# Altium project foxbms2-master.PrjPcb (part 8 of 8)
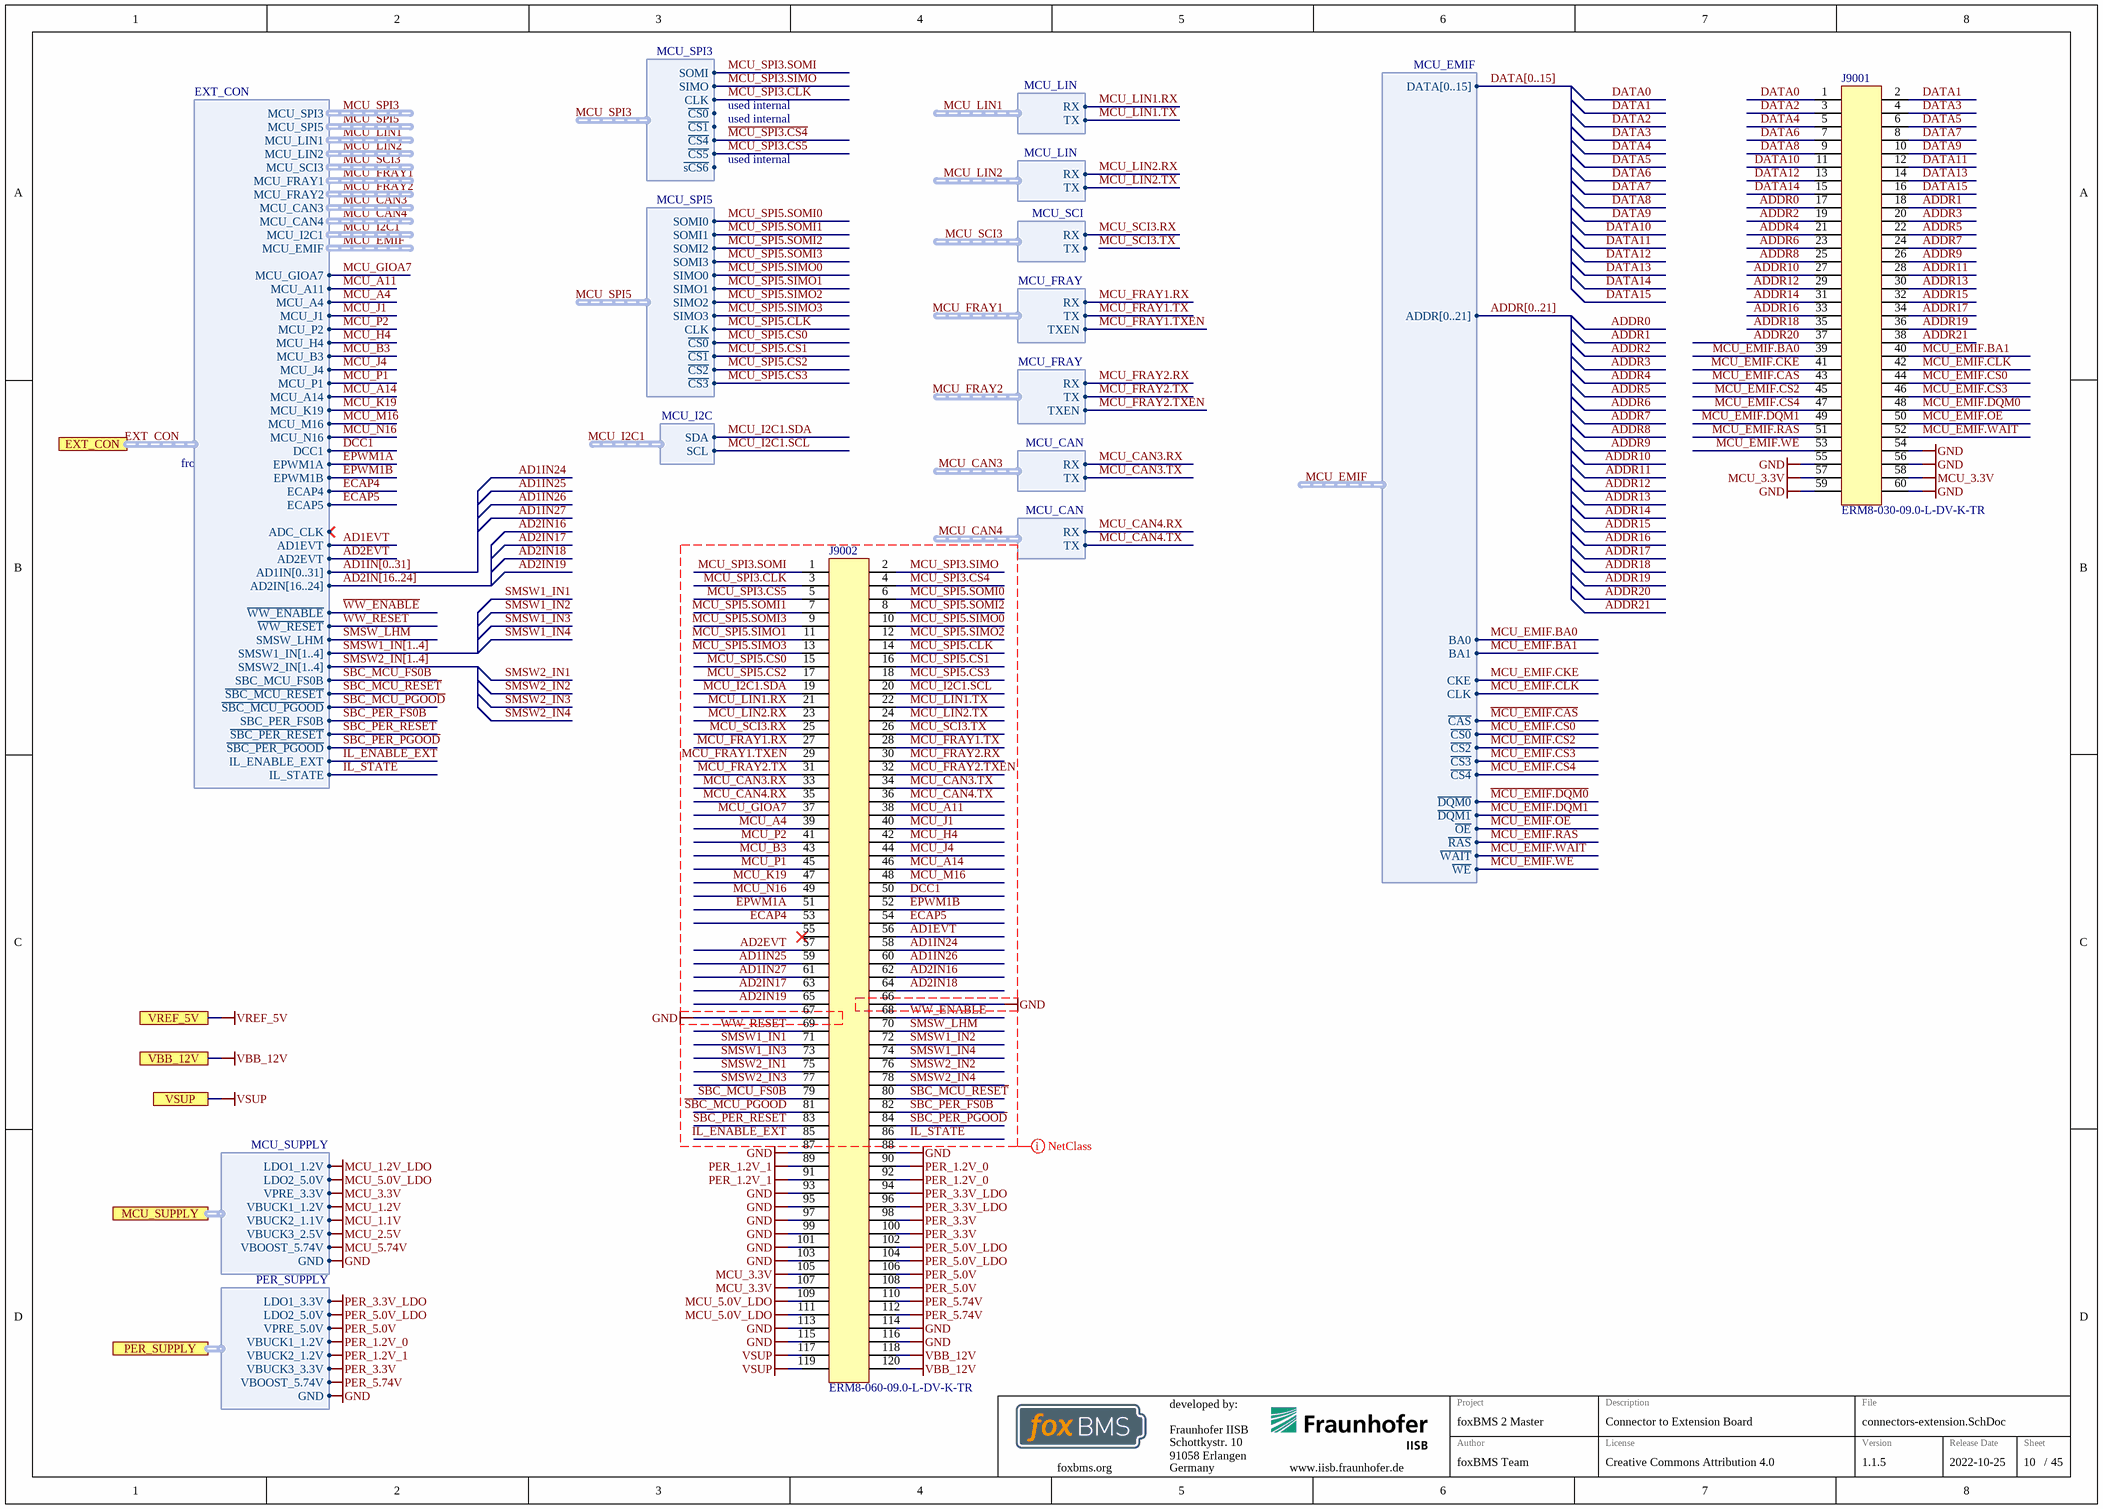
[diagram p46: connectors-extension.SchDoc]

## Nets that join several sheets
GND: mcu-com-gpio-tim (D5000.1 U5000.V4 U5000.W4), mcu-supply (62 pins), mcu-misc (U5000.U2), connectors-external (14 pins), connectors-internal (8 pins), communication/can/can-transceiver1 (13 pins), digital-isolator-3in-1out-power (C1100.1 C1102.1 U1100.2 U1100.8), ethernet-phy (33 pins), rs232-rs485-transceiver (14 pins), oscillator-20MHz (C6100.1 Y6100.2), oscillator-25MHz (C6101.1 Y6101.2), window-watchdog (10 pins), fram (C6203.1 C6204.1 U6201.4), mram (C6205.1 C6206.1 U6202.4 U6202.9), flash (C6200.1 C6201.1 C6202.1 U6200.10), sensor-hum-temp (5 pins), rtc (13 pins), peripherals/port-expanders/port-expander1 (21 pins), peripherals/port-expanders/port-expander2 (20 pins), peripherals/port-expanders/port-expander3 (20 pins), voltage-reference-5.0V (5 pins), smart-switches (R4500.1), io-devices/smart-switches/smart-switch1 (23 pins), io-devices/smart-switches/smart-switch2 (23 pins), contactor-feedback (Q4200.S R4201.1), io-devices/contactor-feedback/contactor-feedback-divider1 (D4200_1.2), io-devices/contactor-feedback/contactor-feedback-divider2 (D4200_2.2), io-devices/contactor-feedback/contactor-feedback-divider3 (D4200_3.2), io-devices/contactor-feedback/contactor-feedback-divider4 (D4200_4.2), io-devices/contactor-feedback/contactor-feedback-divider5 (D4200_5.2), io-devices/contactor-feedback/contactor-feedback-divider6 (D4200_6.2), io-devices/contactor-feedback/contactor-feedback-divider7 (D4200_7.2), io-devices/contactor-feedback/contactor-feedback-divider8 (D4200_8.2), insulation-monitoring (8 pins), supply (9 pins), buck-boost-converter (26 pins), supply/supply-protection-30 (12 pins), sbcs (15 pins), supply/sbcs/sbc-mcu (57 pins), supply/sbcs/sbc-per (57 pins), supply/supply-protection-30C (12 pins), interlock (32 pins), connectors-interface (J9000.32 J9000.33), connectors-extension (19 pins)
GND_ext: connectors-external (J2024.1), communication/can/can-transceiver2 (13 pins), digital-isolator-3in-1out-power (5 pins)
GND_SW: contactor-feedback (Q4200.D), io-devices/contactor-feedback/contactor-feedback-divider1 (R4204_1.1 R4205_1.1), io-devices/contactor-feedback/contactor-feedback-divider2 (R4204_2.1 R4205_2.1), io-devices/contactor-feedback/contactor-feedback-divider3 (R4204_3.1 R4205_3.1), io-devices/contactor-feedback/contactor-feedback-divider4 (R4204_4.1 R4205_4.1), io-devices/contactor-feedback/contactor-feedback-divider5 (R4204_5.1 R4205_5.1), io-devices/contactor-feedback/contactor-feedback-divider6 (R4204_6.1 R4205_6.1), io-devices/contactor-feedback/contactor-feedback-divider7 (R4204_7.1 R4205_7.1), io-devices/contactor-feedback/contactor-feedback-divider8 (R4204_8.1 R4205_8.1)
MCU_1.1V: ethernet-phy (11 pins), sbcs (R7203.2), supply/sbcs/sbc-mcu (5 pins)
MCU_1.2V: mcu-supply (19 pins), sbcs (R7202.2), supply/sbcs/sbc-mcu (5 pins)
MCU_1.2V_LDO: mcu-supply (C5007.2 FB5000.1), sbcs (R7200.2), supply/sbcs/sbc-mcu (C7232_1.2 C7233_1.2 U7200_1.55)
MCU_2.5V: ethernet-phy (8 pins), sbcs (R7204.2), supply/sbcs/sbc-mcu (5 pins)
MCU_3.3V: mcu-supply (38 pins), connectors-internal (6 pins), ethernet-phy (15 pins), oscillator-20MHz (C6100.2 R6100.1 Y6100.4), oscillator-25MHz (C6101.2 R6101.1 Y6101.4), window-watchdog (R6601.2 R6605.2 R6608.2), fram (C6203.2 C6204.2 R6205.2 U6201.8), mram (5 pins), flash (10 pins), rtc (8 pins), insulation-monitoring (D4400.1 D4401.1), supply (R7002.2), buck-boost-converter (R7106.2), supply/sbcs/sbc-mcu (29 pins), connectors-extension (J9001.57 J9001.58 J9002.105 J9002.107)
MCU_5.0V_LDO: mcu-supply (C5010.2 FB5001.1), window-watchdog (R6606.1), sbcs (R7201.2), supply/sbcs/sbc-mcu (C7234_1.2 C7235_1.2 U7200_1.54), connectors-extension (J9002.109 J9002.111)
MCU_5.74V: insulation-monitoring (Q4400.S R4402.2), supply/sbcs/sbc-mcu (C7220_1.2 C7221_1.2 D7201_1.1 U7200_1.53)
PER_1.2V_0: sbcs (R7214.2), supply/sbcs/sbc-per (5 pins), connectors-extension (J9002.90 J9002.92)
PER_1.2V_1: sbcs (R7215.2), supply/sbcs/sbc-per (5 pins), connectors-extension (J9002.89 J9002.91)
PER_3.3V: connectors-internal (J3001.1), communication/can/can-transceiver1 (8 pins), digital-isolator-3in-1out-power (C1100.2 C1102.2 R1100.2 U1100.1), rs232-rs485-transceiver (6 pins), sensor-hum-temp (C6500.2 R6500.2 R6501.2 U6500.5), port-expanders (R6300.2 R6301.2), peripherals/port-expanders/port-expander1 (21 pins), peripherals/port-expanders/port-expander2 (22 pins), peripherals/port-expanders/port-expander3 (22 pins), smart-switches (S4500.2), io-devices/smart-switches/smart-switch1 (7 pins), io-devices/smart-switches/smart-switch2 (7 pins), supply/sbcs/sbc-per (16 pins), interlock (R8020.1 R8024.1), connectors-interface (J9000.34 J9000.35), connectors-extension (J9002.98 J9002.100)
PER_3.3V_LDO: sbcs (R7212.2), supply/sbcs/sbc-per (C7232_2.2 C7233_2.2 U7200_2.55), connectors-extension (J9002.94 J9002.96)
PER_5.0V: communication/can/can-transceiver1 (C1110_1.2 C1111_1.2 C1112_1.2 U1101_1.3), rs232-rs485-transceiver (R1600.1), io-devices/smart-switches/smart-switch1 (C4505_1.2 U4500_1.19), io-devices/smart-switches/smart-switch2 (C4505_2.2 U4500_2.19), supply (R7003.2), sbcs (R7216.2), supply/sbcs/sbc-per (18 pins), interlock (10 pins), connectors-interface (J9000.36 J9000.37), connectors-extension (J9002.106 J9002.108)
PER_5.0V_LDO: sbcs (R7213.2), supply/sbcs/sbc-per (C7234_2.2 C7235_2.2 U7200_2.54), connectors-extension (J9002.102 J9002.104)
PER_5.74V: voltage-reference-5.0V (C4344.2 C4345.2 U4301.2), supply/sbcs/sbc-per (C7220_2.2 C7221_2.2 D7201_2.1 U7200_2.53), connectors-extension (J9002.110 J9002.112)
VBB_12V: connectors-external (9 pins), io-devices/smart-switches/smart-switch1 (10 pins), io-devices/smart-switches/smart-switch2 (10 pins), insulation-monitoring (R4410.2), supply (R7001.2 TP_VBB_12V.1), buck-boost-converter (9 pins), interlock (5 pins), connectors-interface (J9000.38), connectors-extension (J9002.118 J9002.120)
VISO_ext: communication/can/can-transceiver2 (17 pins), digital-isolator-3in-1out-power (C1101.2 C1115.2 R1102.2 U1100.16)
VREF_5V: mcu-supply (FB5002.1), voltage-reference-5.0V (C4346.2 C4347.2 U4301.6)
VSUP_30: communication/can/can-transceiver1 (5 pins), window-watchdog (C6605.2 R6607.1 U6601.5 U6601.8), rtc (D6400.1 Q6401.S R6402.2), supply (D7006.1 R7004.2 TP_VSUP_30.1), supply/supply-protection-30 (C7301_1.2 C7302_1.2 R7301_1.2 U7300_1.5), sbcs (Q7200.S R7223.1), supply/sbcs/sbc-mcu (9 pins), supply/sbcs/sbc-per (9 pins), connectors-interface (J9000.39 J9000.40), connectors-extension (J9002.117 J9002.119)
VSUP_30C: supply (R7000.2 R7006.2 TP_VSUP_30C.1), buck-boost-converter (5 pins), supply/supply-protection-30C (C7301_2.2 C7302_2.2 R7301_2.2 U7300_2.5)
VSUP_ext: connectors-external (J2009.2 J2009.6), supply/supply-protection-30 (5 pins)
VSUP_ext: connectors-external (J2009.3 J2009.7), supply/supply-protection-30C (5 pins)
~{CAN2.STB_iso}: communication/can/can-transceiver2 (R1104_2.1 U1101_2.14), digital-isolator-3in-1out-power (U1100.12)
~{DBG_RESET}: mcu-misc (U5000.B17), connectors-internal (C3000.2 J3008.9 R3004.1), window-watchdog (D6601.1 R6601.1 R6603.2 S6600.2), connectors-extension (J9002.69)
AD1IN24: mcu-adc (U5000.N18), connectors-extension (J9002.58)
AD1IN25: mcu-adc (U5000.P17), connectors-extension (J9002.59)
AD1IN26: mcu-adc (U5000.P16), connectors-extension (J9002.60)
AD1IN27: mcu-adc (U5000.P15), connectors-extension (J9002.61)
AD2IN16: mcu-adc (U5000.W13), connectors-extension (J9002.62)
AD2IN17: mcu-adc (U5000.W12), connectors-extension (J9002.63)
AD2IN18: mcu-adc (U5000.V12), connectors-extension (J9002.64)
AD2IN19: mcu-adc (U5000.U12), connectors-extension (J9002.65)
ADDR0: mcu-emif-etm-dmm (U5000.D4), connectors-extension (J9001.17)
ADDR1: mcu-emif-etm-dmm (U5000.D5), connectors-extension (J9001.18)
ADDR2: mcu-emif-etm-dmm (U5000.E6), connectors-extension (J9001.19)
ADDR3: mcu-emif-etm-dmm (U5000.E7), connectors-extension (J9001.20)
ADDR4: mcu-emif-etm-dmm (U5000.E8), connectors-extension (J9001.21)
ADDR5: mcu-emif-etm-dmm (U5000.E9), connectors-extension (J9001.22)
ADDR6: mcu-emif-etm-dmm (U5000.C4), connectors-extension (J9001.23)
ADDR7: mcu-emif-etm-dmm (U5000.C5), connectors-extension (J9001.24)
ADDR8: mcu-emif-etm-dmm (U5000.C6), connectors-extension (J9001.25)
ADDR9: mcu-emif-etm-dmm (U5000.C7), connectors-extension (J9001.26)
ADDR10: mcu-emif-etm-dmm (U5000.C8), connectors-extension (J9001.27)
ADDR11: mcu-emif-etm-dmm (U5000.C9), connectors-extension (J9001.28)
ADDR12: mcu-emif-etm-dmm (U5000.C10), connectors-extension (J9001.29)
ADDR13: mcu-emif-etm-dmm (U5000.C11), connectors-extension (J9001.30)
ADDR14: mcu-emif-etm-dmm (U5000.C12), connectors-extension (J9001.31)
ADDR15: mcu-emif-etm-dmm (U5000.C13), connectors-extension (J9001.32)
ADDR16: mcu-emif-etm-dmm (U5000.D14), connectors-extension (J9001.33)
ADDR17: mcu-emif-etm-dmm (U5000.C14), connectors-extension (J9001.34)
ADDR18: mcu-emif-etm-dmm (U5000.D15), connectors-extension (J9001.35)
ADDR19: mcu-emif-etm-dmm (U5000.C15), connectors-extension (J9001.36)
ADDR20: mcu-emif-etm-dmm (U5000.C16), connectors-extension (J9001.37)
ADDR21: mcu-emif-etm-dmm (U5000.C17), connectors-extension (J9001.38)
CAN1-CTRL~{.}STB: communication/can/can-transceiver1 (R1104_1.1 U1101_1.14), peripherals/port-expanders/port-expander2 (R6303_2.1 R6321_2.2 U6300_2.5)
CAN1-CTRL.EN: communication/can/can-transceiver1 (R1103_1.1 U1101_1.6), peripherals/port-expanders/port-expander2 (R6302_2.1 R6320_2.2 U6300_2.4)
CAN1.H: connectors-external (J2021.4), communication/can/can-transceiver1 (D1102_1.1 L1100_1.4 R1110_1.2 R1111_1.2)
CAN1.L: connectors-external (J2021.3), communication/can/can-transceiver1 (D1102_1.2 L1100_1.1 R1112_1.2 R1113_1.2)
CAN2-CTRL~{.}STB: digital-isolator-3in-1out-power (U1100.5), peripherals/port-expanders/port-expander2 (R6305_2.1 R6323_2.2 U6300_2.7)
CAN2-CTRL.EN: digital-isolator-3in-1out-power (U1100.4), peripherals/port-expanders/port-expander2 (R6304_2.1 R6322_2.2 U6300_2.6)
CAN2.EN_iso: communication/can/can-transceiver2 (R1103_2.1 U1101_2.6), digital-isolator-3in-1out-power (U1100.13)
CAN2.RX_iso: communication/can/can-transceiver2 (R1108_2.1), digital-isolator-3in-1out-power (U1100.11)
CAN2.TX_iso: communication/can/can-transceiver2 (R1107_2.1), digital-isolator-3in-1out-power (U1100.14)
COM_IO~{.}ETH_INT: mcu-com-gpio-tim (U5000.J2), ethernet-phy (R1222.1 U1200.44)
COM_IO.CAN_FAULT: mcu-com-gpio-tim (U5000.G2), communication/can/can-transceiver1 (Q1101_1.D R1114_1.2)
COM_IO.INH: can (R1101.2), supply (D7004.1), supply/sbcs/sbc-mcu (C7217_1.2 R7229_1.2 S7200_1.1)
COM_IO_PE.IO1_2: ethernet-phy (U1200.43), peripherals/port-expanders/port-expander2 (R6312_2.1 R6330_2.2 U6300_2.15)
COM_IO_PE.IO1_4: rs232-rs485-transceiver (U1600.26), peripherals/port-expanders/port-expander2 (R6314_2.1 R6332_2.2 U6300_2.17)
CONT_FB.IO0_0: connectors-external (J2000.1), io-devices/contactor-feedback/contactor-feedback-divider1 (R4202_1.2 R4203_1.2)
CONT_FB.IO0_1: connectors-external (J2002.1), io-devices/contactor-feedback/contactor-feedback-divider2 (R4202_2.2 R4203_2.2)
CONT_FB.IO0_2: connectors-external (J2003.1), io-devices/contactor-feedback/contactor-feedback-divider3 (R4202_3.2 R4203_3.2)
CONT_FB.IO0_3: connectors-external (J2004.1), io-devices/contactor-feedback/contactor-feedback-divider4 (R4202_4.2 R4203_4.2)
CONT_FB.IO0_4: connectors-external (J2006.1), io-devices/contactor-feedback/contactor-feedback-divider5 (R4202_5.2 R4203_5.2)
CONT_FB.IO0_5: connectors-external (J2007.1), io-devices/contactor-feedback/contactor-feedback-divider6 (R4202_6.2 R4203_6.2)
CONT_FB.IO0_6: connectors-external (J2008.1), io-devices/contactor-feedback/contactor-feedback-divider7 (R4202_7.2 R4203_7.2)
CONT_FB.IO0_7: connectors-external (J2010.1), io-devices/contactor-feedback/contactor-feedback-divider8 (R4202_8.2 R4203_8.2)
CONT_FB_IO.IO0_0: peripherals/port-expanders/port-expander1 (R6302_1.1 R6320_1.2 U6300_1.4), io-devices/contactor-feedback/contactor-feedback-divider1 (D4200_1.1 R4206_1.1)
CONT_FB_IO.IO0_1: peripherals/port-expanders/port-expander1 (R6303_1.1 R6321_1.2 U6300_1.5), io-devices/contactor-feedback/contactor-feedback-divider2 (D4200_2.1 R4206_2.1)
CONT_FB_IO.IO0_2: peripherals/port-expanders/port-expander1 (R6304_1.1 R6322_1.2 U6300_1.6), io-devices/contactor-feedback/contactor-feedback-divider3 (D4200_3.1 R4206_3.1)
CONT_FB_IO.IO0_3: peripherals/port-expanders/port-expander1 (R6305_1.1 R6323_1.2 U6300_1.7), io-devices/contactor-feedback/contactor-feedback-divider4 (D4200_4.1 R4206_4.1)
CONT_FB_IO.IO0_4: peripherals/port-expanders/port-expander1 (R6306_1.1 R6324_1.2 U6300_1.8), io-devices/contactor-feedback/contactor-feedback-divider5 (D4200_5.1 R4206_5.1)
CONT_FB_IO.IO0_5: peripherals/port-expanders/port-expander1 (R6307_1.1 R6325_1.2 U6300_1.9), io-devices/contactor-feedback/contactor-feedback-divider6 (D4200_6.1 R4206_6.1)
CONT_FB_IO.IO0_6: peripherals/port-expanders/port-expander1 (R6308_1.1 R6326_1.2 U6300_1.10), io-devices/contactor-feedback/contactor-feedback-divider7 (D4200_7.1 R4206_7.1)
CONT_FB_IO.IO0_7: peripherals/port-expanders/port-expander1 (R6309_1.1 R6327_1.2 U6300_1.11), io-devices/contactor-feedback/contactor-feedback-divider8 (D4200_8.1 R4206_8.1)
DATA0: mcu-emif-etm-dmm (U5000.K15), connectors-extension (J9001.1)
DATA1: mcu-emif-etm-dmm (U5000.L15), connectors-extension (J9001.2)
DATA2: mcu-emif-etm-dmm (U5000.M15), connectors-extension (J9001.3)
DATA3: mcu-emif-etm-dmm (U5000.N15), connectors-extension (J9001.4)
DATA4: mcu-emif-etm-dmm (U5000.E5), connectors-extension (J9001.5)
DATA5: mcu-emif-etm-dmm (U5000.F5), connectors-extension (J9001.6)
DATA6: mcu-emif-etm-dmm (U5000.G5), connectors-extension (J9001.7)
DATA7: mcu-emif-etm-dmm (U5000.K5), connectors-extension (J9001.8)
DATA8: mcu-emif-etm-dmm (U5000.L5), connectors-extension (J9001.9)
DATA9: mcu-emif-etm-dmm (U5000.M5), connectors-extension (J9001.10)
DATA10: mcu-emif-etm-dmm (U5000.N5), connectors-extension (J9001.11)
DATA11: mcu-emif-etm-dmm (U5000.P5), connectors-extension (J9001.12)
DATA12: mcu-emif-etm-dmm (U5000.R5), connectors-extension (J9001.13)
DATA13: mcu-emif-etm-dmm (U5000.R6), connectors-extension (J9001.14)
DATA14: mcu-emif-etm-dmm (U5000.R7), connectors-extension (J9001.15)
DATA15: mcu-emif-etm-dmm (U5000.R8), connectors-extension (J9001.16)
ETHERNET.RX1_N: connectors-external (J2001.6), ethernet-phy (T1200.9)
ETHERNET.RX1_P: connectors-external (J2001.3), ethernet-phy (T1200.11)
ETHERNET.RX2_N: connectors-external (J2001.8), ethernet-phy (T1201.9)
ETHERNET.RX2_P: connectors-external (J2001.7), ethernet-phy (T1201.11)
ETHERNET.SHIELD: connectors-external (J2001.S1 J2001.S2), ethernet-phy (R1220.2)
ETHERNET.TX1_N: connectors-external (J2001.2), ethernet-phy (T1200.14)
ETHERNET.TX1_P: connectors-external (J2001.1), ethernet-phy (T1200.16)
ETHERNET.TX2_N: connectors-external (J2001.5), ethernet-phy (T1201.14)
ETHERNET.TX2_P: connectors-external (J2001.4), ethernet-phy (T1201.16)
EXT_CON~{.}SBC_MCU_PGOOD: mcu-misc (U5000.W7), supply/sbcs/sbc-mcu (C7237_1.2 R7241_1.1 R7249_1.2), connectors-extension (J9002.81)
EXT_CON~{.}SBC_MCU_RESET: window-watchdog (C6604.2 R6605.1 U6600.2), supply/sbcs/sbc-mcu (C7236_1.2 R7240_1.1 R7248_1.1), connectors-extension (J9002.80)
EXT_CON~{.}SBC_PER_PGOOD: supply/sbcs/sbc-per (C7237_2.2 R7241_2.1 R7249_2.2), connectors-extension (J9002.84)
EXT_CON~{.}SBC_PER_RESET: supply/sbcs/sbc-per (C7236_2.2 R7240_2.1 R7248_2.1), connectors-extension (J9002.83)
EXT_CON~{.}WW_ENABLE: window-watchdog (R6600.1 R6602.2), connectors-extension (J9002.68)
EXT_CON.AD1EVT: mcu-adc (U5000.N19), connectors-extension (J9002.56)
EXT_CON.AD2EVT: mcu-adc (U5000.T10), connectors-extension (J9002.57)
EXT_CON.ADC_CLK: mcu-misc (U5000.K1), oscillator-20MHz (Y6100.3)
EXT_CON.DCC1: mcu-com-gpio-tim (U5000.J17), connectors-extension (J9002.50)
EXT_CON.ECAP4: mcu-com-gpio-tim (U5000.G19), connectors-extension (J9002.53)
EXT_CON.ECAP5: mcu-com-gpio-tim (U5000.H18), connectors-extension (J9002.54)
EXT_CON.EPWM1A: mcu-com-gpio-tim (U5000.D9), connectors-extension (J9002.51)
EXT_CON.EPWM1B: mcu-com-gpio-tim (U5000.D10), connectors-extension (J9002.52)
EXT_CON.IL_ENABLE_EXT: interlock (R8026.1), connectors-extension (J9002.85)
EXT_CON.IL_STATE: mcu-com-gpio-tim (U5000.A3), interlock (R8020.2 U8002.7), connectors-extension (J9002.86)
EXT_CON.MCU_A4: mcu-com-gpio-tim (U5000.A4), connectors-extension (J9002.39)
EXT_CON.MCU_A11: mcu-com-gpio-tim (U5000.A11), connectors-extension (J9002.38)
EXT_CON.MCU_A14: mcu-com-gpio-tim (U5000.A14), connectors-extension (J9002.46)
EXT_CON.MCU_B3: mcu-com-gpio-tim (U5000.B3), connectors-extension (J9002.43)
EXT_CON.MCU_GIOA7: mcu-com-gpio-tim (U5000.M1), connectors-extension (J9002.37)
EXT_CON.MCU_H4: mcu-com-gpio-tim (U5000.H4), connectors-extension (J9002.42)
EXT_CON.MCU_J1: mcu-com-gpio-tim (U5000.J1), connectors-extension (J9002.40)
EXT_CON.MCU_J4: mcu-com-gpio-tim (U5000.J4), connectors-extension (J9002.44)
EXT_CON.MCU_K19: mcu-com-gpio-tim (U5000.K19), connectors-extension (J9002.47)
EXT_CON.MCU_M16: mcu-com-gpio-tim (U5000.M16), connectors-extension (J9002.48)
EXT_CON.MCU_N16: mcu-com-gpio-tim (U5000.N16), connectors-extension (J9002.49)
EXT_CON.MCU_P1: mcu-com-gpio-tim (U5000.P1), connectors-extension (J9002.45)
EXT_CON.MCU_P2: mcu-com-gpio-tim (U5000.P2), connectors-extension (J9002.41)
EXT_CON.SBC_MCU_FS0B: supply/sbcs/sbc-mcu (C7243_1.2 R7243_1.2), connectors-extension (J9002.79)
EXT_CON.SBC_PER_FS0B: supply/sbcs/sbc-per (C7243_2.2 R7243_2.2), connectors-extension (J9002.82)
EXT_CON.SMSW_LHM: smart-switches (R4500.2 S4500.1), io-devices/smart-switches/smart-switch1 (U4500_1.18), io-devices/smart-switches/smart-switch2 (U4500_2.18), connectors-extension (J9002.70)
FLASH_SPI~{.}CS: mcu-com-gpio-tim (U5000.V10), flash (R6200.1 U6200.7)
FLASH_SPI.CLK: mcu-com-gpio-tim (U5000.V9), fram (U6201.6), mram (U6202.6), flash (U6200.16), connectors-extension (J9002.3)
FLASH_SPI.MISO: mcu-com-gpio-tim (U5000.V8), fram (U6201.2), mram (U6202.2), flash (R6201.1 U6200.8), connectors-extension (J9002.1)
FLASH_SPI.MOSI: mcu-com-gpio-tim (U5000.W8), fram (U6201.5), mram (U6202.5), flash (U6200.15), connectors-extension (J9002.2)
FRAM_SPI~{.}CS: mcu-com-gpio-tim (U5000.V5), fram (U6201.1)
IF_CON~{.}IF_INT0: mcu-com-gpio-tim (U5000.C1), connectors-interface (J9000.20)
IF_CON~{.}IF_INT1: mcu-com-gpio-tim (U5000.E1), connectors-interface (J9000.21)
IF_CON~{.}IF_INT2: mcu-com-gpio-tim (U5000.A6), connectors-interface (J9000.22)
IF_CON~{.}IF_INT3: mcu-com-gpio-tim (U5000.H3), connectors-interface (J9000.23)
IF_GPIO.0: peripherals/port-expanders/port-expander3 (R6310_3.1 R6328_3.2 U6300_3.13), connectors-interface (J9000.24)
IF_GPIO.1: peripherals/port-expanders/port-expander3 (R6311_3.1 R6329_3.2 U6300_3.14), connectors-interface (J9000.25)
IF_GPIO.2: peripherals/port-expanders/port-expander3 (R6312_3.1 R6330_3.2 U6300_3.15), connectors-interface (J9000.26)
IF_GPIO.3: peripherals/port-expanders/port-expander3 (R6313_3.1 R6331_3.2 U6300_3.16), connectors-interface (J9000.27)
IF_GPIO.4: peripherals/port-expanders/port-expander3 (R6314_3.1 R6332_3.2 U6300_3.17), connectors-interface (J9000.28)
IF_GPIO.5: peripherals/port-expanders/port-expander3 (R6315_3.1 R6333_3.2 U6300_3.18), connectors-interface (J9000.29)
IF_GPIO.6: peripherals/port-expanders/port-expander3 (R6316_3.1 R6334_3.2 U6300_3.19), connectors-interface (J9000.30)
IF_GPIO.7: peripherals/port-expanders/port-expander3 (R6317_3.1 R6335_3.2 U6300_3.20), connectors-interface (J9000.31)
INTERLOCK.HI: connectors-external (J2033.1), interlock (5 pins)
INTERLOCK.LO: connectors-external (J2033.2), interlock (D8001.5 R8010.2 R8014.2 R8016.1)
INTERLOCK_IO.IL_HS_CS: mcu-adc (U5000.U18), interlock (C8001.2 R8006.1 TP8001.1)
INTERLOCK_IO.IL_HS_ENABLE: mcu-com-gpio-tim (U5000.B11), interlock (R8027.1)
INTERLOCK_IO.IL_HS_VS: mcu-adc (U5000.V18), interlock (C8000.2 R8001.1 TP8000.1)
INTERLOCK_IO.IL_LS_CS: mcu-adc (U5000.R17), interlock (C8005.2 R8015.1 TP8003.1)
INTERLOCK_IO.IL_LS_VS: mcu-adc (U5000.T17), interlock (C8002.2 R8009.1 TP8002.1)
IODEV_IO~{.}SMSW_FAULT: mcu-com-gpio-tim (U5000.M2), io-devices/smart-switches/smart-switch1 (R4513_1.1 U4500_1.4), io-devices/smart-switches/smart-switch2 (R4513_2.1 U4500_2.4)
IODEV_IO~{.}SMSW_RESET: mcu-com-gpio-tim (U5000.L4), io-devices/smart-switches/smart-switch1 (U4500_1.21), io-devices/smart-switches/smart-switch2 (U4500_2.21)
IODEV_IO.CONT_FB_EN: mcu-com-gpio-tim (U5000.L16), contactor-feedback (R4200.1)
IODEV_IO.IM_OK: mcu-com-gpio-tim (U5000.A9), insulation-monitoring (D4400.2 R4401.2)
IODEV_IO.IM_PWM: mcu-com-gpio-tim (U5000.N1), insulation-monitoring (D4401.2 R4403.2)
IODEV_IO.IM_SUP_EN: mcu-com-gpio-tim (U5000.M3), insulation-monitoring (R4400.1)
iso_CAN2.H: connectors-external (J2024.4), communication/can/can-transceiver2 (D1102_2.1 L1100_2.4 R1110_2.2 R1111_2.2)
iso_CAN2.L: connectors-external (J2024.3), communication/can/can-transceiver2 (D1102_2.2 L1100_2.1 R1112_2.2 R1113_2.2)
ISOMON.OK: connectors-external (J2034.3), insulation-monitoring (R4404.2)
ISOMON.PWM: connectors-external (J2034.4), insulation-monitoring (R4406.2 R4409.1)
ISOMON.SUP-: connectors-external (J2034.1), insulation-monitoring (Q4402.D)
MCU_CAN1.RX: mcu-com-gpio-tim (U5000.B10), communication/can/can-transceiver1 (R1108_1.1)
MCU_CAN1.TX: mcu-com-gpio-tim (U5000.A10), communication/can/can-transceiver1 (R1107_1.1)
MCU_CAN2.RX: mcu-com-gpio-tim (U5000.H1), digital-isolator-3in-1out-power (U1100.6)
MCU_CAN2.TX: mcu-com-gpio-tim (U5000.H2), digital-isolator-3in-1out-power (U1100.3)
MCU_CAN3.RX: mcu-com-gpio-tim (U5000.M19), connectors-extension (J9002.33)
MCU_CAN3.TX: mcu-com-gpio-tim (U5000.M18), connectors-extension (J9002.34)
MCU_CAN4.RX: mcu-com-gpio-tim (U5000.W10), connectors-extension (J9002.35)
MCU_CAN4.TX: mcu-com-gpio-tim (U5000.F2), connectors-extension (J9002.36)
MCU_CLK.2.22MHz: mcu-misc (U5000.A12), supply/sbcs/sbc-mcu (R7251_1.1 U7200_1.20)
MCU_CLK.25MHz: mcu-misc (U5000.B5), ethernet-phy (U1200.20), oscillator-25MHz (Y6101.3)
MCU_DCC.2: mcu-com-gpio-tim (U5000.D6), rtc (U6400.6)
MCU_EMIF~{.}CAS: mcu-emif-etm-dmm (U5000.R4), connectors-extension (J9001.43)
MCU_EMIF~{.}CS0: mcu-emif-etm-dmm (U5000.N17), connectors-extension (J9001.44)
MCU_EMIF~{.}CS2: mcu-emif-etm-dmm (U5000.L17), connectors-extension (J9001.45)
MCU_EMIF~{.}CS3: mcu-emif-etm-dmm (U5000.K17), connectors-extension (J9001.46)
MCU_EMIF~{.}CS4: mcu-emif-etm-dmm (U5000.M17), connectors-extension (J9001.47)
MCU_EMIF~{.}DQM0: mcu-emif-etm-dmm (U5000.E10), connectors-extension (J9001.48)
MCU_EMIF~{.}DQM1: mcu-emif-etm-dmm (U5000.E11), connectors-extension (J9001.49)
MCU_EMIF~{.}OE: mcu-emif-etm-dmm (U5000.E12), connectors-extension (J9001.50)
MCU_EMIF~{.}RAS: mcu-emif-etm-dmm (U5000.R3), connectors-extension (J9001.51)
MCU_EMIF~{.}WAIT: mcu-emif-etm-dmm (U5000.P3), connectors-extension (J9001.52)
MCU_EMIF~{.}WE: mcu-emif-etm-dmm (U5000.D17), connectors-extension (J9001.53)
MCU_EMIF.BA0: mcu-emif-etm-dmm (U5000.E13), connectors-extension (J9001.39)
MCU_EMIF.BA1: mcu-emif-etm-dmm (U5000.D16), connectors-extension (J9001.40)
MCU_EMIF.CKE: mcu-emif-etm-dmm (U5000.L3), connectors-extension (J9001.41)
MCU_EMIF.CLK: mcu-emif-etm-dmm (U5000.K3), connectors-extension (J9001.42)
MCU_ETM.CLKIN: mcu-emif-etm-dmm (U5000.R9), connectors-internal (R3009.1)
MCU_ETM.CLKOUT: mcu-emif-etm-dmm (U5000.R10), connectors-internal (J3008.6)
MCU_ETM.CTL: mcu-emif-etm-dmm (U5000.R11), connectors-internal (J3008.36)
MCU_ETM.DATA0: mcu-emif-etm-dmm (U5000.R12), connectors-internal (J3008.38)
MCU_ETM.DATA1: mcu-emif-etm-dmm (U5000.R13), connectors-internal (J3008.28)
MCU_ETM.DATA2: mcu-emif-etm-dmm (U5000.J15), connectors-internal (J3008.26)
MCU_ETM.DATA3: mcu-emif-etm-dmm (U5000.H15), connectors-internal (J3008.24)
MCU_ETM.DATA4: mcu-emif-etm-dmm (U5000.G15), connectors-internal (J3008.22)
MCU_ETM.DATA5: mcu-emif-etm-dmm (U5000.F15), connectors-internal (J3008.20)
MCU_ETM.DATA6: mcu-emif-etm-dmm (U5000.E15), connectors-internal (J3008.18)
MCU_ETM.DATA7: mcu-emif-etm-dmm (U5000.E14), connectors-internal (J3008.16)
MCU_FRAY1.RX: mcu-com-gpio-tim (U5000.A15), connectors-extension (J9002.27)
MCU_FRAY1.TX: mcu-com-gpio-tim (U5000.B15), connectors-extension (J9002.28)
MCU_FRAY1.TXEN: mcu-com-gpio-tim (U5000.B16), connectors-extension (J9002.29)
MCU_FRAY2.RX: mcu-com-gpio-tim (U5000.A8), connectors-extension (J9002.30)
MCU_FRAY2.TX: mcu-com-gpio-tim (U5000.B8), connectors-extension (J9002.31)
MCU_FRAY2.TXEN: mcu-com-gpio-tim (U5000.B9), connectors-extension (J9002.32)
MCU_GIOA.0: mcu-com-gpio-tim (U5000.A5), supply/sbcs/sbc-mcu (U7200_1.33)
MCU_GIOA.1: mcu-com-gpio-tim (U5000.C2), supply/sbcs/sbc-per (U7200_2.33)
MCU_GIOB.1: mcu-com-gpio-tim (U5000.K2), rtc (R6401.1 U6400.12)
MCU_GIOB.4: mcu-com-gpio-tim (U5000.G1), peripherals/port-expanders/port-expander1 (R6318_1.1 U6300_1.1), peripherals/port-expanders/port-expander2 (R6318_2.1 U6300_2.1), peripherals/port-expanders/port-expander3 (R6318_3.1 U6300_3.1)
MCU_GIOB.7: mcu-com-gpio-tim (U5000.F1), buck-boost-converter (R7106.1 U7100.17)
MCU_GIOX.D11: mcu-com-gpio-tim (U5000.D11), rtc (R6410.1 U6400.10)
MCU_GIOX.D12: mcu-com-gpio-tim (U5000.D12), rtc (R6409.1 U6400.9)
MCU_GIOX.D13: mcu-com-gpio-tim (U5000.D13), rtc (R6408.1 U6400.8)
MCU_GIOX.K4: mcu-com-gpio-tim (U5000.K4), window-watchdog (R6604.1)
MCU_GIOX.K16: mcu-com-gpio-tim (U5000.K16), rtc (R6411.1 U6400.11)
MCU_GIOX.M4: mcu-com-gpio-tim (U5000.M4), peripherals/port-expanders/port-expander1 (R6319_1.1 U6300_1.3), peripherals/port-expanders/port-expander2 (R6319_2.1 U6300_2.3), peripherals/port-expanders/port-expander3 (R6319_3.1 U6300_3.3)
MCU_GIOX.N4: mcu-com-gpio-tim (U5000.N4), sbcs (Q7201.G R7225.1)
MCU_GIOX.T6: mcu-com-gpio-tim (U5000.T6), buck-boost-converter (R7105.1 U7100.1)
MCU_GIOX.T7: mcu-com-gpio-tim (U5000.T7), supply/sbcs/sbc-mcu (U7200_1.30)
MCU_GIOX.T8: mcu-com-gpio-tim (U5000.T8), supply/sbcs/sbc-per (U7200_2.30)
MCU_I2C1.SCL: mcu-com-gpio-tim (U5000.C3), sensor-hum-temp (R6500.1 U6500.4), rtc (R6403.1 U6400.2), port-expanders (R6301.1), peripherals/port-expanders/port-expander1 (U6300_1.22), peripherals/port-expanders/port-expander2 (U6300_2.22), peripherals/port-expanders/port-expander3 (U6300_3.22), connectors-extension (J9002.20)
MCU_I2C1.SDA: mcu-com-gpio-tim (U5000.B2), sensor-hum-temp (R6501.1 U6500.1), rtc (R6404.1 U6400.5), port-expanders (R6300.1), peripherals/port-expanders/port-expander1 (U6300_1.23), peripherals/port-expanders/port-expander2 (U6300_2.23), peripherals/port-expanders/port-expander3 (U6300_3.23), connectors-extension (J9002.19)
MCU_JTAG~{.}TRST: mcu-misc (U5000.D18), connectors-internal (R3000.2 R3150.1)
MCU_JTAG.RTCK: mcu-misc (U5000.A16), connectors-internal (J3008.13)
MCU_JTAG.TCK: mcu-misc (U5000.B18), connectors-internal (R3150.4)
MCU_JTAG.TDI: mcu-misc (U5000.A17), connectors-internal (R3150.2)
MCU_JTAG.TDO: mcu-misc (U5000.C18), connectors-internal (J3008.11)
MCU_JTAG.TMS: mcu-misc (U5000.C19), connectors-internal (R3150.3)
MCU_LIN1.RX: mcu-com-gpio-tim (U5000.A7), connectors-extension (J9002.21)
MCU_LIN1.TX: mcu-com-gpio-tim (U5000.B7), connectors-extension (J9002.22)
MCU_LIN2.RX: mcu-com-gpio-tim (U5000.P4), connectors-extension (J9002.23)
MCU_LIN2.TX: mcu-com-gpio-tim (U5000.T5), connectors-extension (J9002.24)
MCU_MII.RXCLK: mcu-com-gpio-tim (U5000.T4), ethernet-phy (U1200.32)
MCU_MII.RXCTRL: mcu-com-gpio-tim (U5000.U6), ethernet-phy (R1203.1 R1215.2 U1200.38)
MCU_MII.RXD0: mcu-com-gpio-tim (U5000.U4), ethernet-phy (U1200.33)
MCU_MII.RXD1: mcu-com-gpio-tim (U5000.T3), ethernet-phy (U1200.34)
MCU_MII.RXD2: mcu-com-gpio-tim (U5000.U3), ethernet-phy (U1200.35)
MCU_MII.RXD3: mcu-com-gpio-tim (U5000.V3), ethernet-phy (U1200.36)
MCU_MII.RXER: mcu-com-gpio-tim (U5000.U5), ethernet-phy (R1201.1 R1213.2 U1200.46)
MCU_MII.TXCLK: mcu-com-gpio-tim (U5000.U7), ethernet-phy (U1200.29)
MCU_MII.TXD0: mcu-com-gpio-tim (U5000.U8), ethernet-phy (U1200.25)
MCU_MII.TXD1: mcu-com-gpio-tim (U5000.R1), ethernet-phy (U1200.26)
MCU_MII.TXD2: mcu-com-gpio-tim (U5000.T2), ethernet-phy (U1200.27)
MCU_MII.TXD3: mcu-com-gpio-tim (U5000.G4), ethernet-phy (U1200.28)
MCU_MII.TXEN: mcu-com-gpio-tim (U5000.E4), ethernet-phy (U1200.37)
MCU_RST~{.}ERROR: mcu-misc (U5000.B14), sbcs (R7211.1), supply/sbcs/sbc-mcu (U7200_1.31)
MCU_SCI3.RX: mcu-com-gpio-tim (U5000.W3), connectors-extension (J9002.25)
MCU_SCI4.RX: mcu-com-gpio-tim (U5000.A13), rs232-rs485-transceiver (U1600.2)
MCU_SCI4.TX: mcu-com-gpio-tim (U5000.B13), rs232-rs485-transceiver (U1600.7)
MCU_SMI.MDC: mcu-com-gpio-tim (U5000.T9), ethernet-phy (U1200.42)
MCU_SMI.MDIO: mcu-com-gpio-tim (U5000.F4), ethernet-phy (U1200.41)
MCU_SPI1~{.}CS1: mcu-com-gpio-tim (U5000.F3), connectors-interface (J9000.6)
MCU_SPI1~{.}CS2: mcu-com-gpio-tim (U5000.G3), connectors-interface (J9000.7)
MCU_SPI1~{.}CS3: mcu-com-gpio-tim (U5000.J3), connectors-interface (J9000.8)
MCU_SPI1~{.}CS4: mcu-com-gpio-tim (U5000.U10), connectors-interface (J9000.9)
MCU_SPI1~{.}CS5: mcu-com-gpio-tim (U5000.U9), connectors-interface (J9000.10)
MCU_SPI1.CLK: mcu-com-gpio-tim (U5000.F18), connectors-interface (J9000.5)
MCU_SPI1.SIMO0: mcu-com-gpio-tim (U5000.F19), connectors-interface (J9000.3)
MCU_SPI1.SIMO1: mcu-com-gpio-tim (U5000.E18), connectors-interface (J9000.4)
MCU_SPI1.SOMI0: mcu-com-gpio-tim (U5000.G18), connectors-interface (J9000.1)
MCU_SPI1.SOMI1: mcu-com-gpio-tim (U5000.R2), connectors-interface (J9000.2)
MCU_SPI2~{.}CS0: mcu-com-gpio-tim (U5000.N3), supply/sbcs/sbc-mcu (R7247_1.1)
MCU_SPI2~{.}CS1: mcu-com-gpio-tim (U5000.D3), supply/sbcs/sbc-per (R7247_2.1)
MCU_SPI2~{.}sCS2: mcu-com-gpio-tim (U5000.D8), io-devices/smart-switches/smart-switch1 (U4500_1.6), io-devices/smart-switches/smart-switch2 (U4500_2.6)
MCU_SPI2.CLK: mcu-com-gpio-tim (U5000.E2), io-devices/smart-switches/smart-switch1 (U4500_1.8), io-devices/smart-switches/smart-switch2 (U4500_2.8), supply/sbcs/sbc-mcu (U7200_1.27), supply/sbcs/sbc-per (U7200_2.27)
MCU_SPI2.SIMO: mcu-com-gpio-tim (U5000.D1), io-devices/smart-switches/smart-switch1 (U4500_1.7), supply/sbcs/sbc-mcu (U7200_1.26), supply/sbcs/sbc-per (U7200_2.26)
MCU_SPI2.SOMI: mcu-com-gpio-tim (U5000.D2), io-devices/smart-switches/smart-switch2 (U4500_2.9), supply/sbcs/sbc-mcu (U7200_1.25), supply/sbcs/sbc-per (U7200_2.25)
MCU_SPI3~{.}CS4: mcu-com-gpio-tim (U5000.E3), connectors-extension (J9002.4)
MCU_SPI3~{.}CS5: mcu-com-gpio-tim (U5000.W9), connectors-extension (J9002.5)
MCU_SPI3~{.}sCS6: mcu-com-gpio-tim (U5000.D7), mram (U6202.1)
MCU_SPI4~{.}CS0: mcu-com-gpio-tim (U5000.U1), connectors-interface (J9000.14)
MCU_SPI4~{.}CS1: mcu-com-gpio-tim (U5000.B12), connectors-interface (J9000.15)
MCU_SPI4~{.}CS2: mcu-com-gpio-tim (U5000.T1), connectors-interface (J9000.16)
MCU_SPI4~{.}CS3: mcu-com-gpio-tim (U5000.V7), connectors-interface (J9000.17)
MCU_SPI4~{.}CS4: mcu-com-gpio-tim (U5000.D19), connectors-interface (J9000.18)
MCU_SPI4~{.}CS5: mcu-com-gpio-tim (U5000.B4), connectors-interface (J9000.19)
MCU_SPI4.CLK: mcu-com-gpio-tim (U5000.K18), connectors-interface (J9000.13)
MCU_SPI4.SIMO: mcu-com-gpio-tim (U5000.W5), connectors-interface (J9000.12)
MCU_SPI4.SOMI: mcu-com-gpio-tim (U5000.V6), connectors-interface (J9000.11)
MCU_SPI5~{.}CS0: mcu-com-gpio-tim (U5000.E19), connectors-extension (J9002.15)
MCU_SPI5~{.}CS1: mcu-com-gpio-tim (U5000.B6), connectors-extension (J9002.16)
MCU_SPI5~{.}CS2: mcu-com-gpio-tim (U5000.W6), connectors-extension (J9002.17)
MCU_SPI5~{.}CS3: mcu-com-gpio-tim (U5000.T12), connectors-extension (J9002.18)
MCU_SPI5.CLK: mcu-com-gpio-tim (U5000.H19), connectors-extension (J9002.14)
MCU_SPI5.SIMO0: mcu-com-gpio-tim (U5000.J19), connectors-extension (J9002.10)
MCU_SPI5.SIMO1: mcu-com-gpio-tim (U5000.E16), connectors-extension (J9002.11)
MCU_SPI5.SIMO2: mcu-com-gpio-tim (U5000.H17), connectors-extension (J9002.12)
MCU_SPI5.SIMO3: mcu-com-gpio-tim (U5000.G17), connectors-extension (J9002.13)
MCU_SPI5.SOMI0: mcu-com-gpio-tim (U5000.J18), connectors-extension (J9002.6)
MCU_SPI5.SOMI1: mcu-com-gpio-tim (U5000.E17), connectors-extension (J9002.7)
MCU_SPI5.SOMI2: mcu-com-gpio-tim (U5000.H16), connectors-extension (J9002.8)
MCU_SPI5.SOMI3: mcu-com-gpio-tim (U5000.G16), connectors-extension (J9002.9)
NetC7201_1: sbcs (C7201.1 R7210.2), supply/sbcs/sbc-mcu (U7200_1.41)
NetC7203_1: sbcs (C7203.1 R7222.2), supply/sbcs/sbc-per (U7200_2.41)
NetR1101_1: can (R1101.1), communication/can/can-transceiver1 (U1101_1.7)
NetR7211_2: sbcs (R7211.2), supply/sbcs/sbc-per (U7200_2.31)
NetR7251_2_1: supply/sbcs/sbc-mcu (U7200_1.24), supply/sbcs/sbc-per (R7251_2.1 U7200_2.20)
NetU4500_1_9: io-devices/smart-switches/smart-switch1 (U4500_1.9), io-devices/smart-switches/smart-switch2 (U4500_2.7)
PE_IO3.IO0_0: sensor-hum-temp (U6500.6), peripherals/port-expanders/port-expander3 (R6302_3.1 R6320_3.2 U6300_3.4)
PE_IO3.IO0_1: sensor-hum-temp (U6500.3), peripherals/port-expanders/port-expander3 (R6303_3.1 R6321_3.2 U6300_3.5)
PER_IO~{.}RTC_INTA_HV: rtc (Q6401.D R6406.2), supply/sbcs/sbc-mcu (C7225_1.2 R7231_1.2)
RS485.A: connectors-external (J2013.2), rs232-rs485-transceiver (R1611.1 R1612.2 R1613.2 U1600.22)
RS485.B: connectors-external (J2013.5), rs232-rs485-transceiver (U1600.21)
RS485.Y: connectors-external (J2013.1), rs232-rs485-transceiver (U1600.19)
RS485.Z: connectors-external (J2013.4), rs232-rs485-transceiver (R1609.1 R1610.1 R1611.2 U1600.17)
SBC_MCU_OTP.DBG: connectors-internal (J3000.6), supply/sbcs/sbc-mcu (D7203_1.2)
SBC_MCU_OTP.DBGHV: connectors-internal (J3000.4), supply/sbcs/sbc-mcu (D7203_1.1 R7235_1.1 U7200_1.8)
SBC_MCU_OTP.SCL: connectors-internal (J3000.5), supply/sbcs/sbc-mcu (R7237_1.1 U7200_1.10)
SBC_MCU_OTP.SDA: connectors-internal (J3000.3), supply/sbcs/sbc-mcu (R7236_1.1 U7200_1.11)
SBC_PER_OTP.DBG: connectors-internal (J3001.6), supply/sbcs/sbc-per (D7203_2.2)
SBC_PER_OTP.DBGHV: connectors-internal (J3001.4), supply/sbcs/sbc-per (D7203_2.1 R7235_2.1 U7200_2.8)
SBC_PER_OTP.SCL: connectors-internal (J3001.5), supply/sbcs/sbc-per (R7237_2.1 U7200_2.10)
SBC_PER_OTP.SDA: connectors-internal (J3001.3), supply/sbcs/sbc-per (R7236_2.1 U7200_2.11)
SMSW1_IN1: io-devices/smart-switches/smart-switch1 (R4514_1.1), connectors-extension (J9002.71)
SMSW1_IN2: io-devices/smart-switches/smart-switch1 (R4515_1.1), connectors-extension (J9002.72)
SMSW1_IN3: io-devices/smart-switches/smart-switch1 (R4516_1.1), connectors-extension (J9002.73)
SMSW1_IN4: io-devices/smart-switches/smart-switch1 (R4517_1.1), connectors-extension (J9002.74)
SMSW2_IN1: io-devices/smart-switches/smart-switch2 (R4514_2.1), connectors-extension (J9002.75)
SMSW2_IN2: io-devices/smart-switches/smart-switch2 (R4515_2.1), connectors-extension (J9002.76)
SMSW2_IN3: io-devices/smart-switches/smart-switch2 (R4516_2.1), connectors-extension (J9002.77)
SMSW2_IN4: io-devices/smart-switches/smart-switch2 (R4517_2.1), connectors-extension (J9002.78)
SMSW_OUT1.1: connectors-external (J2000.3), io-devices/smart-switches/smart-switch1 (C4502_1.2 D4500_1.1 R4501_1.2 U4500_1.3)
SMSW_OUT1.2: connectors-external (J2002.3), io-devices/smart-switches/smart-switch1 (C4504_1.2 D4501_1.1 R4502_1.2 U4500_1.26)
SMSW_OUT1.3: connectors-external (J2003.3), io-devices/smart-switches/smart-switch1 (C4506_1.2 D4502_1.1 R4503_1.2 U4500_1.12)
SMSW_OUT1.4: connectors-external (J2004.3), io-devices/smart-switches/smart-switch1 (C4507_1.2 D4503_1.1 R4508_1.2 U4500_1.17)
SMSW_OUT2.1: connectors-external (J2006.3), io-devices/smart-switches/smart-switch2 (C4502_2.2 D4500_2.1 R4501_2.2 U4500_2.3)
SMSW_OUT2.2: connectors-external (J2007.3), io-devices/smart-switches/smart-switch2 (C4504_2.2 D4501_2.1 R4502_2.2 U4500_2.26)
SMSW_OUT2.3: connectors-external (J2008.3), io-devices/smart-switches/smart-switch2 (C4506_2.2 D4502_2.1 R4503_2.2 U4500_2.12)
SMSW_OUT2.4: connectors-external (J2010.3), io-devices/smart-switches/smart-switch2 (C4507_2.2 D4503_2.1 R4508_2.2 U4500_2.17)
SUPPLY_ext.15_IGNITION: connectors-external (J2009.1), supply (R7005.2)
SUPPLY_IO.SBC_MCU_ADC: mcu-adc (U5000.W14), supply/sbcs/sbc-mcu (C7245_1.2 R7244_1.2)
SUPPLY_IO.SBC_PER_ADC: mcu-adc (U5000.V17), supply/sbcs/sbc-per (C7245_2.2 R7244_2.2)
SUPPLY_IO.VSUP_30C_SENSE: mcu-adc (U5000.T19), supply (C7001.2 R7007.2)
VCOREMON: sbcs (R7202.1), supply/sbcs/sbc-mcu (U7200_1.17)
VCOREMON: sbcs (R7214.1), supply/sbcs/sbc-per (U7200_2.17)
VMON1: sbcs (R7203.1 R7208.2), supply/sbcs/sbc-mcu (U7200_1.16)
VMON1: sbcs (R7216.1 R7221.2), supply/sbcs/sbc-per (U7200_2.16)
VMON2: sbcs (R7204.1 R7209.2), supply/sbcs/sbc-mcu (U7200_1.15)
VMON2: sbcs (R7215.1 R7220.2), supply/sbcs/sbc-per (U7200_2.15)
VMON3: sbcs (R7200.1 R7205.2), supply/sbcs/sbc-mcu (U7200_1.13)
VMON3: sbcs (R7212.1 R7217.2), supply/sbcs/sbc-per (U7200_2.13)
VMON4: sbcs (R7201.1 R7206.2), supply/sbcs/sbc-mcu (U7200_1.12)
VMON4: sbcs (R7213.1 R7218.2), supply/sbcs/sbc-per (U7200_2.12)
WAKE2: sbcs (Q7200.D R7224.2), supply/sbcs/sbc-per (C7225_2.2 R7231_2.2)

## Assembly variants
default: not fitted BT6401 Q1101_2 R1100 R1106 R1114_2 R1115_2 R1200 R1202 R1203 R1205 R1207 R1208 R1210 R1212 R1213 R1214 R1601 R1602 R1603 R1604 R1609 R1610 R1611 R1612 R1613 R4202_1 R4202_2 R4202_3 R4202_4 R4202_5 R4202_6 R4202_7 R4202_8 R4204_1 R4204_2 R4204_3 R4204_4 R4204_5 R4204_6 R4204_7 R4204_8 R4410 R4504_1 R4504_2 R4505_1 R4505_2 R4506_1 R4506_2 R4507_1 R4507_2 R4514_1 R4514_2 R4515_1 R4515_2 R4516_1 R4516_2 R4517_1 R4517_2 R6100 R6302_1 R6302_2 R6302_3 R6303_1 R6303_2 R6303_3 R6304_1 R6304_2 R6304_3 R6305_1 R6305_2 R6305_3 R6306_1 R6306_2 R6306_3 R6307_1 R6307_2 R6307_3 R6308_1 R6308_2 R6308_3 R6309_1 R6309_2 R6309_3 R6310_1 R6310_2 R6310_3 R6311_1 R6311_2 R6311_3 R6312_1 R6312_2 R6312_3 R6313_1 R6313_2 R6313_3 R6314_1 R6314_2 R6314_3 R6315_1 R6315_2 R6315_3 R6316_1 R6316_2 R6316_3 R6317_1 R6317_2 R6317_3 R6320_1 R6321_1 R6322_1 R6323_1 R6324_1 R6325_1 R6326_1 R6327_1 R6403 R6404 R6500 R6501 R6603 R6606 R7115 R7219_1 R7219_2 R7310_1 R7310_2 U8000
production: not fitted BT6401 C7100 C7101 C7102 C7103 C7104 C7105 C7106 C7107 C7108 C7109 C7110 C7111 C7112 C7113 C7114 C7115 C7116 C7117 C7118 C7119 C7120 D7100 D7101 D7102 L7100 Q1101_2 Q7100 Q7101 Q7102 Q7103 R1106 R1114_2 R1115_2 R1200 R1202 R1203 R1205 R1207 R1208 R1210 R1212 R1213 R1214 R1601 R1602 R1603 R1604 R1609 R1610 R1611 R1612 R1613 R4202_1 R4202_2 R4202_3 R4202_4 R4202_5 R4202_6 R4202_7 R4202_8 R4204_1 R4204_2 R4204_3 R4204_4 R4204_5 R4204_6 R4204_7 R4204_8 R4410 R4504_1 R4504_2 R4505_1 R4505_2 R4506_1 R4506_2 R4507_1 R4507_2 R4514_1 R4514_2 R4515_1 R4515_2 R4516_1 R4516_2 R4517_1 R4517_2 R6100 R6302_1 R6302_2 R6302_3 R6303_1 R6303_2 R6303_3 R6304_1 R6304_2 R6304_3 R6305_1 R6305_2 R6305_3 R6306_1 R6306_2 R6306_3 R6307_1 R6307_2 R6307_3 R6308_1 R6308_2 R6308_3 R6309_1 R6309_2 R6309_3 R6310_1 R6310_2 R6310_3 R6311_1 R6311_2 R6311_3 R6312_1 R6312_2 R6312_3 R6313_1 R6313_2 R6313_3 R6314_1 R6314_2 R6314_3 R6315_1 R6315_2 R6315_3 R6316_1 R6316_2 R6316_3 R6317_1 R6317_2 R6317_3 R6320_1 R6321_1 R6322_1 R6323_1 R6324_1 R6325_1 R6326_1 R6327_1 R6403 R6404 R6500 R6501 R6603 R6606 R7100 R7101 R7102 R7103 R7104 R7105 R7106 R7107 R7108 R7109 R7110 R7111 R7112 R7113 R7114 R7219_1 R7219_2 R7310_1 R7310_2 U6202 U7100 U8000; alternate parts U1100 -> ADUM6401CRIZ